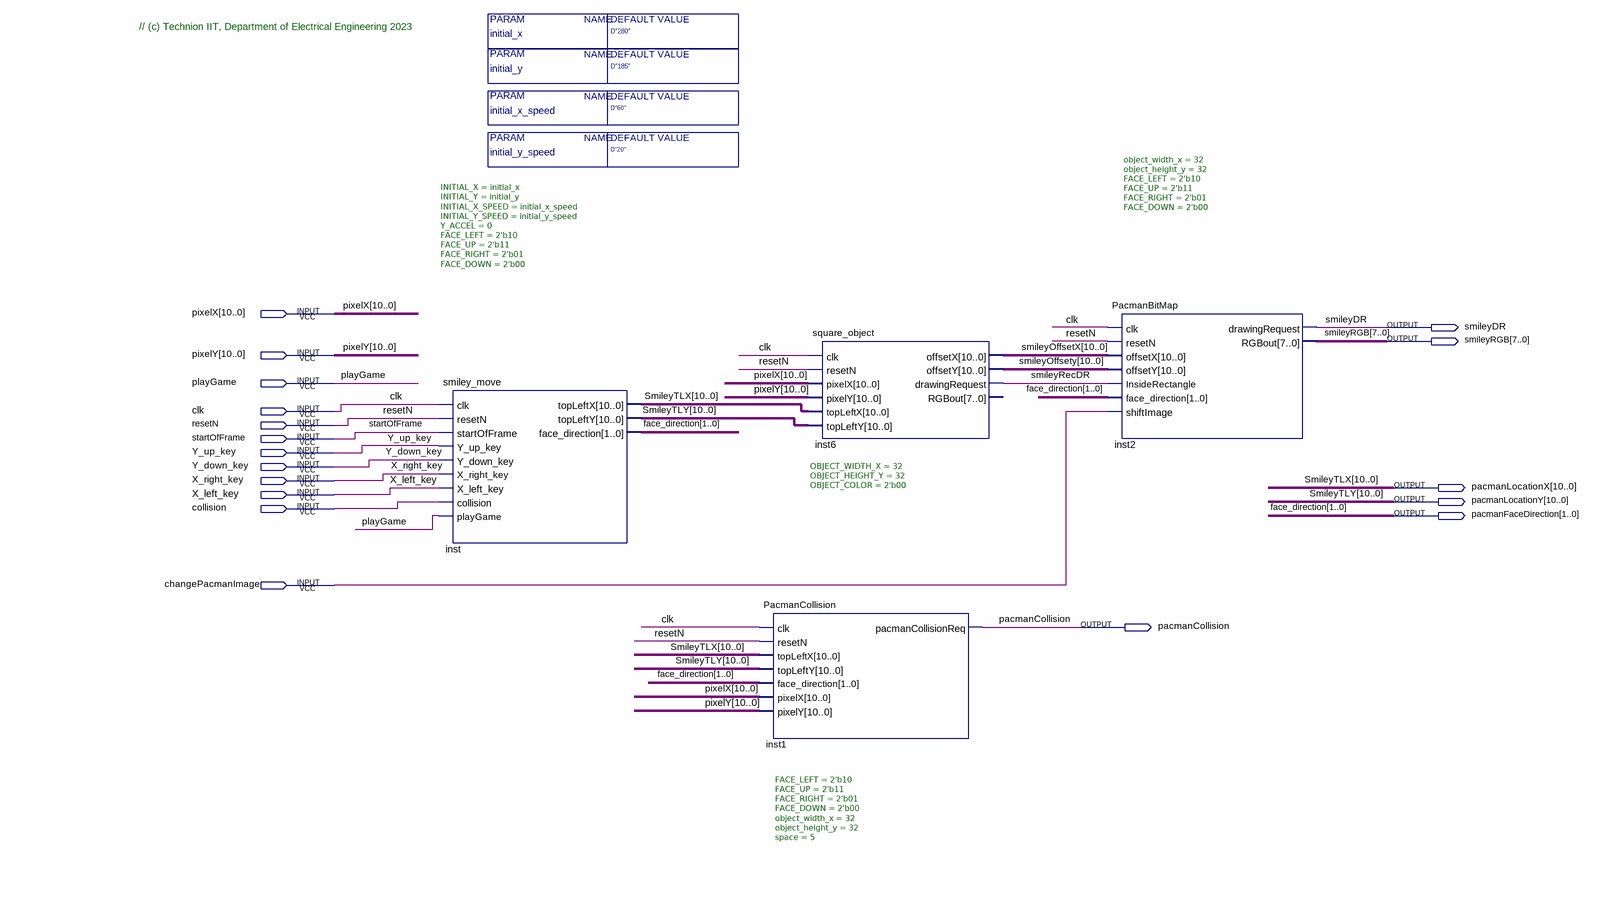
[diagram p0: schematic sheet]
// Quartus schematic Smiley_Block_T.bdf as structural Verilog: 4 symbols, 18 pins
module Smiley_Block_T #(parameter initial_x = "D\"280\"", parameter initial_y = "D\"185\"", parameter initial_x_speed = "D\"60\"", parameter initial_y_speed = "D\"20\"") (
  input  [10:0] pixelX,
  input  [10:0] pixelY,
  input  playGame,
  input  clk,
  input  resetN,
  input  startOfFrame,
  input  Y_up_key,
  input  Y_down_key,
  input  X_right_key,
  input  X_left_key,
  input  collision,
  input  changePacmanImage,
  output smileyDR,
  output [7:0] smileyRGB,
  output [10:0] pacmanLocationX,
  output [10:0] pacmanLocationY,
  output [1:0] pacmanFaceDirection,
  output pacmanCollision
);

  wire smileyRecDR;
  wire [10:0] smileyOffsetX, smileyOffsety;

  smiley_move #(.INITIAL_X(initial_x), .INITIAL_Y(initial_y), .INITIAL_X_SPEED(initial_x_speed), .INITIAL_Y_SPEED(initial_y_speed), .Y_ACCEL(0), .FACE_LEFT(2'b10), .FACE_UP(2'b11), .FACE_RIGHT(2'b01), .FACE_DOWN(2'b00)) inst (
    .clk(clk), .resetN(resetN), .startOfFrame(startOfFrame), .Y_up_key(Y_up_key), .Y_down_key(Y_down_key),
    .X_right_key(X_right_key), .X_left_key(X_left_key), .collision(collision), .playGame(playGame),
    .topLeftX(pacmanLocationX), .topLeftY(pacmanLocationY), .face_direction(pacmanFaceDirection));
  PacmanCollision #(.FACE_LEFT(2'b10), .FACE_UP(2'b11), .FACE_RIGHT(2'b01), .FACE_DOWN(2'b00), .object_width_x(32), .object_height_y(32), .space(5)) inst1 (
    .clk(clk), .resetN(resetN), .topLeftX(pacmanLocationX), .topLeftY(pacmanLocationY),
    .face_direction(pacmanFaceDirection), .pixelX(pixelX), .pixelY(pixelY),
    .pacmanCollisionReq(pacmanCollision));
  square_object #(.OBJECT_WIDTH_X(32), .OBJECT_HEIGHT_Y(32), .OBJECT_COLOR(2'b00)) inst6 (
    .clk(clk), .resetN(resetN), .pixelX(pixelX), .pixelY(pixelY), .topLeftX(pacmanLocationX),
    .topLeftY(pacmanLocationY), .offsetX(smileyOffsetX), .offsetY(smileyOffsety), .drawingRequest(smileyRecDR));  // open: RGBout
  PacmanBitMap #(.object_width_x(32), .object_height_y(32), .FACE_LEFT(2'b10), .FACE_UP(2'b11), .FACE_RIGHT(2'b01), .FACE_DOWN(2'b00)) inst2 (
    .clk(clk), .resetN(resetN), .offsetX(smileyOffsetX), .offsetY(smileyOffsety),
    .InsideRectangle(smileyRecDR), .face_direction(pacmanFaceDirection), .shiftImage(changePacmanImage),
    .drawingRequest(smileyDR), .RGBout(smileyRGB));

  // Other names for the same wires on the sheet: face_direction[1:0] = pacmanFaceDirection;
  //   SmileyTLX[10:0] = pacmanLocationX; SmileyTLY[10:0] = pacmanLocationY

  // Notes on the sheet:
  //   // (c) Technion IIT, Department of Electrical Engineering 2023
endmodule
